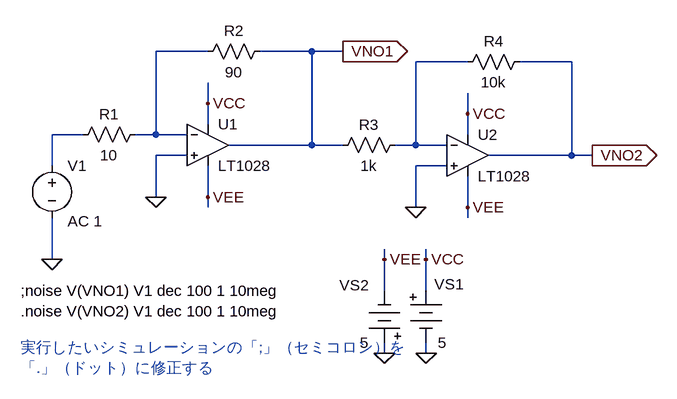
[diagram p0: schematic fig-03-02-23.asc]
fig-03-02-23.asc, the LTspice schematic file:
Version 4
SHEET 1 924 680
WIRE 208 32 128 32
WIRE 368 32 288 32
WIRE 416 32 368 32
WIRE 608 48 528 48
WIRE 768 48 688 48
WIRE 208 112 208 80
WIRE 608 128 608 96
WIRE 208 144 208 112
WIRE 16 160 -32 160
WIRE 128 160 128 32
WIRE 128 160 96 160
WIRE 176 160 128 160
WIRE 608 160 608 128
WIRE 368 176 368 32
WIRE 368 176 240 176
WIRE 416 176 368 176
WIRE 528 176 528 48
WIRE 528 176 496 176
WIRE 576 176 528 176
WIRE 176 192 128 192
WIRE 768 192 768 48
WIRE 768 192 640 192
WIRE 800 192 768 192
WIRE -32 208 -32 160
WIRE 576 208 528 208
WIRE 128 256 128 192
WIRE 208 256 208 208
WIRE 208 272 208 256
WIRE 528 272 528 208
WIRE 608 272 608 224
WIRE 608 288 608 272
WIRE -32 352 -32 288
WIRE 480 352 480 336
WIRE 544 352 544 336
WIRE 480 400 480 352
WIRE 544 400 544 352
WIRE 480 496 480 480
WIRE 544 496 544 480
FLAG 128 256 0
FLAG -32 352 0
FLAG 416 32 VNO1
IOPIN 416 32 Out
FLAG 480 496 0
FLAG 544 496 0
FLAG 480 352 VEE
FLAG 544 352 VCC
FLAG 208 112 VCC
FLAG 208 256 VEE
FLAG 528 272 0
FLAG 800 192 VNO2
IOPIN 800 192 Out
FLAG 608 128 VCC
FLAG 608 272 VEE
SYMBOL res 304 16 R90
WINDOW 0 0 56 VBottom 2
WINDOW 3 32 56 VTop 2
SYMATTR InstName R2
SYMATTR Value 90
SYMBOL Misc\\battery 544 384 R0
WINDOW 0 13 6 Left 2
WINDOW 3 18 96 Left 2
WINDOW 123 0 0 Left 0
WINDOW 39 0 0 Left 0
SYMATTR InstName VS1
SYMATTR Value 5
SYMBOL Misc\\battery 480 496 R180
WINDOW 0 24 104 Left 2
WINDOW 3 24 16 Left 2
WINDOW 123 0 0 Left 0
WINDOW 39 0 0 Left 0
SYMATTR InstName VS2
SYMATTR Value 5
SYMBOL res 112 144 R90
WINDOW 0 0 56 VBottom 2
WINDOW 3 32 56 VTop 2
SYMATTR InstName R1
SYMATTR Value 10
SYMBOL voltage -32 192 R0
WINDOW 3 31 91 Invisible 2
WINDOW 123 24 101 Left 2
WINDOW 39 0 0 Left 0
SYMATTR Value ""
SYMATTR Value2 AC 1
SYMATTR InstName V1
SYMBOL Opamps\\LT1028 208 112 R0
SYMATTR InstName U1
SYMBOL res 704 32 R90
WINDOW 0 0 56 VBottom 2
WINDOW 3 32 56 VTop 2
SYMATTR InstName R4
SYMATTR Value 10k
SYMBOL Opamps\\LT1028 608 128 R0
SYMATTR InstName U2
SYMBOL res 512 160 R90
WINDOW 0 0 56 VBottom 2
WINDOW 3 32 56 VTop 2
SYMATTR InstName R3
SYMATTR Value 1k
TEXT -80 400 Left 2 !;noise V(VNO1) V1 dec 100 1 10meg
TEXT -80 432 Left 2 !.noise V(VNO2) V1 dec 100 1 10meg
TEXT -80 488 Left 2 ;実行したいシミュレーションの「;」（セミコロン）を\n「.」（ドット）に修正する

The netlist it stands for:
* fig-03-02-23.asc
R2 VNO1 N001 90
VS1 VCC 0 5
VS2 0 VEE 5
R1 N001 N003 10
V1 N003 0 AC 1
XU1 0 N001 VCC VEE VNO1 LT1028  ; pins In+ In- V+ V- OUT
R4 VNO2 N002 10k
XU2 0 N002 VCC VEE VNO2 LT1028  ; pins In+ In- V+ V- OUT
R3 N002 VNO1 1k
;noise V(VNO1) V1 dec 100 1 10meg
.noise V(VNO2) V1 dec 100 1 10meg
* 実行したいシミュレーションの「;」（セミコロン）を
* 「.」（ドット）に修正する
.lib LTC.lib
.backanno
.end